# Altium schematic sheet schematic.SchDoc
size A2; SheetNumber: 6; SheetTotal: 29
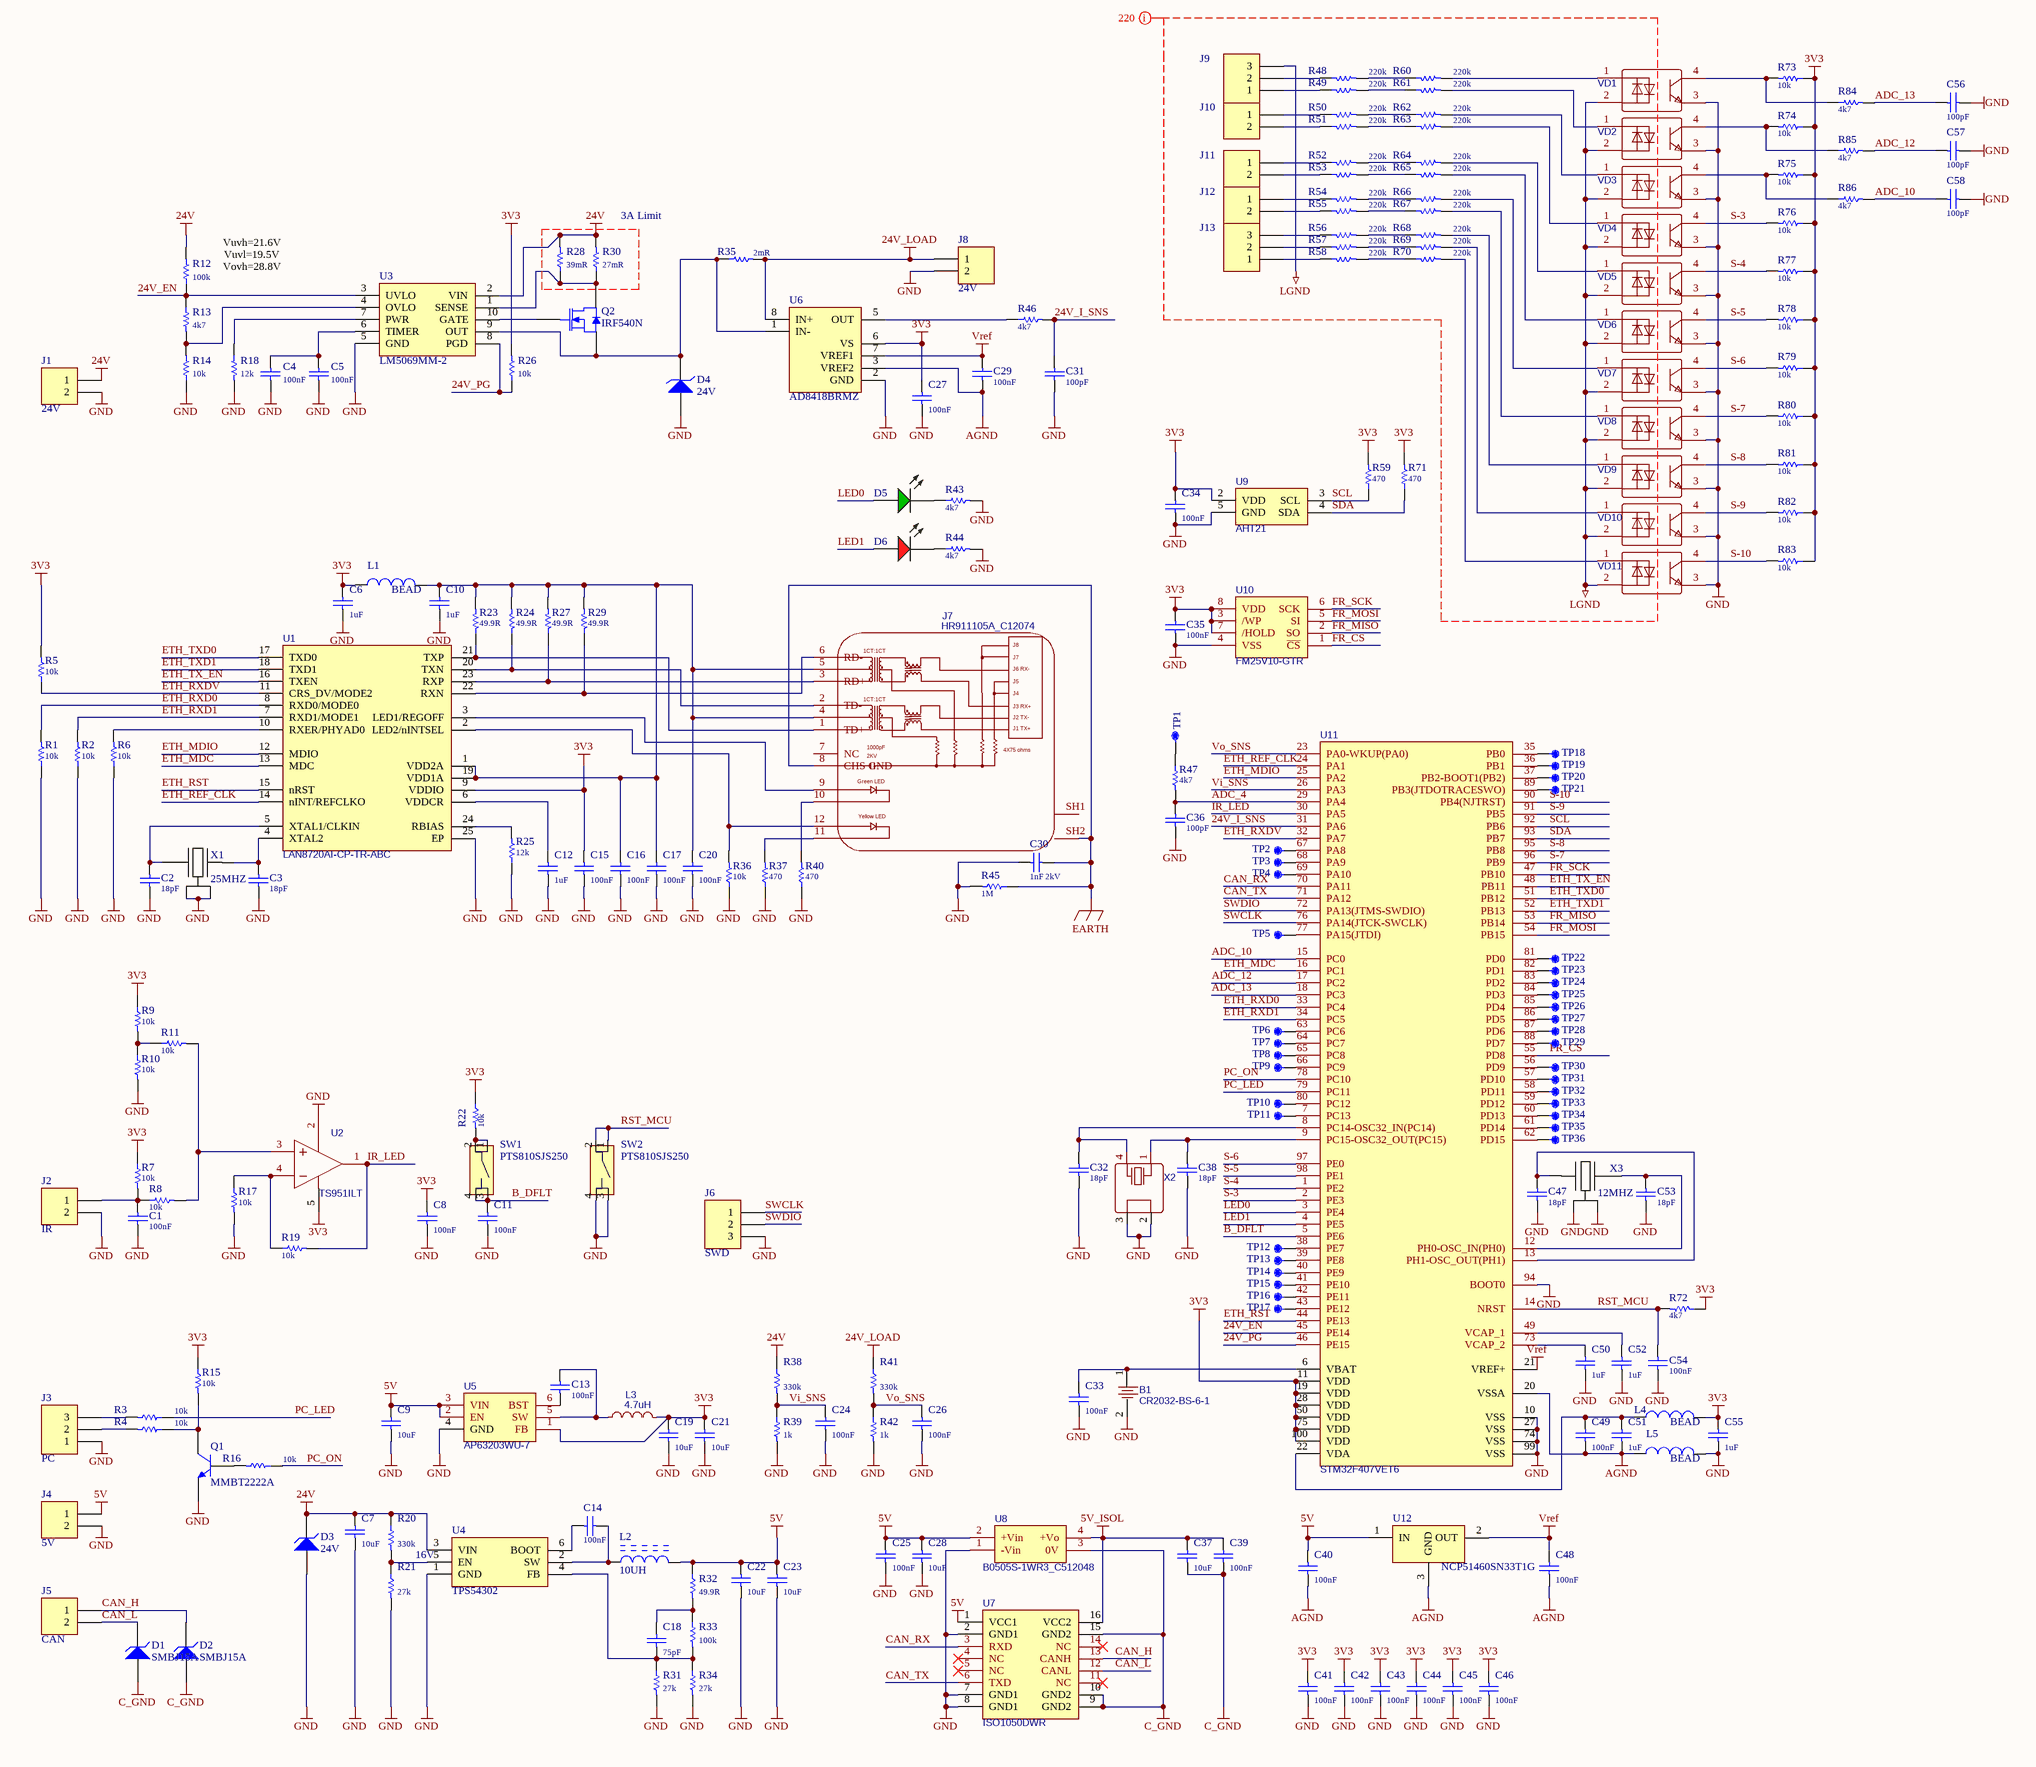
[diagram p0: schematic.SchDoc]

## Parts
B1  CR2032-BS-6-1  [BAT-TH_CR2032-BS-6-1]
C1  100nF  [C0603]
C2  18pF  [C0402]
C3  18pF  [C0402]
C4  100nF  [C0402]
C5  100nF  [C0402]
C6  1uF  [C0603]
C7  10uF  [C1206]
C8  100nF  [C0402]
C9  10uF  [C1206]
C10  1uF  [C0603]
C11  100nF  [C0402]
C12  1uF  [C0603]
C13  100nF  [C0402]
C14  100nF  [C0603]
C15  100nF  [C0402]
C16  100nF  [C0402]
C17  100nF  [C0402]
C18  75pF  [C0603]
C19  10uF  [C1206]
C20  100nF  [C0402]
C21  10uF  [C1206]
C22  10uF  [C1206]
C23  10uF  [C1206]
C24  100nF  [C0603]
C25  100nF  [C0402]
C26  100nF  [C0603]
C27  100nF  [C0402]
C28  10uF  [C1206]
C29  100nF  [C0402]
C30  1nF 2kV  [C1206]
C31  100pF  [C0402]
C32  18pF  [C0402]
C33  100nF  [C0402]
C34  100nF  [C0402]
C35  100nF  [C0402]
C36  100pF  [C0402]
C37  10uF  [C1206]
C38  18pF  [C0402]
C39  100nF  [C0402]
C40  100nF  [C0402]
C41  100nF  [C0402]
C42  100nF  [C0402]
C43  100nF  [C0402]
C44  100nF  [C0402]
C45  100nF  [C0402]
C46  100nF  [C0402]
C47  18pF  [C0402]
C48  100nF  [C0402]
C49  100nF  [C0402]
C50  1uF  [C0603]
C51  1uF  [C0603]
C52  1uF  [C0603]
C53  18pF  [C0402]
C54  100nF  [C0402]
C55  1uF  [C0603]
C56  100pF  [C0402]
C57  100pF  [C0402]
C58  100pF  [C0402]
D1  SMBJ15A  [SMB]
D2  SMBJ15A  [SMB]
D3  24V  [SMB]
D4  24V  [SMC]
D5  GRN  [LED-0603-GRN]  (value not drawn)
D6  RED  [LED-0603-RED]  (value not drawn)
J1  24V  [CONN-TH_2P-P5.08]
J2  IR  [CONN-TH_2P-P5.08]
J3  PC  [CONN-TH_DB127V-5.08-3P]
J4  5V  [CONN-TH_2P-P5.08]
J5  CAN  [CONN-TH_2P-P5.08]
J6  SWD  [HDR-1X3]  (no BOM)
J7  HR911105A_C12074  [RJ45-TH_HR911105A]
J8  24V  [CONN-TH_2P-P5.08]
J9  (no value)  [CONN-TH_DB127V-5.08-3P]
J10  (no value)  [CONN-TH_2P-P5.08]
J11  (no value)  [CONN-TH_2P-P5.08]
J12  (no value)  [CONN-TH_2P-P5.08]
J13  (no value)  [CONN-TH_DB127V-5.08-3P]
L1  BEAD  [L0603]
L2  10UH  [IND-SMD_L7.2-W6.6_GPSR07X0]
L3  4.7uH  [IND-SMD_L4.4-W4.2]
L4  BEAD  [L0402]
L5  BEAD  [L0402]
Q1  MMBT2222A  [SOT-23]
Q2  IRF540N  [D2PAK]
R1  10k  [R0402]
R2  10k  [R0402]
R3  10k  [R0603]
R4  10k  [R0603]
R5  10k  [R0402]
R6  10k  [R0402]
R7  10k  [R0603]
R8  10k  [R0603]
R9  10k  [R0603]
R10  10k  [R0603]
R11  10k  [R0603]
R12  100k  [R0402]
R13  4k7  [R0402]
R14  10k  [R0402]
R15  10k  [R0603]
R16  10k  [R0603]
R17  10k  [R0603]
R18  12k  [R0603]
R19  10k  [R0603]
R20  330k  [R0603]
R21  27k  [R0603]
R22  10k  [R0402]
R23  49.9R  [R0603]
R24  49.9R  [R0603]
R25  12k  [R0402]
R26  10k  [R0402]
R27  49.9R  [R0603]
R28  39mR  [R1206]
R29  49.9R  [R0603]
R30  27mR  [R1206]
R31  27k  [R0603]
R32  49.9R  [R0603]
R33  100k  [R0603]
R34  27k  [R0603]
R35  2mR  [R2512-WIDE]
R36  10k  [R0603]
R37  470  [R0603]
R38  330k  [R0603]
R39  1k  [R0603]
R40  470  [R0603]
R41  330k  [R0603]
R42  1k  [R0603]
R43  4k7  [R0402]
R44  4k7  [R0402]
R45  1M  [R1206]
R46  4k7  [R0402]
R47  4k7  [R0402]
R48  220k  [R1206]
R49  220k  [R1206]
R50  220k  [R1206]
R51  220k  [R1206]
R52  220k  [R1206]
R53  220k  [R1206]
R54  220k  [R1206]
R55  220k  [R1206]
R56  220k  [R1206]
R57  220k  [R1206]
R58  220k  [R1206]
R59  470  [R0603]
R60  220k  [R1206]
R61  220k  [R1206]
R62  220k  [R1206]
R63  220k  [R1206]
R64  220k  [R1206]
R65  220k  [R1206]
R66  220k  [R1206]
R67  220k  [R1206]
R68  220k  [R1206]
R69  220k  [R1206]
R70  220k  [R1206]
R71  470  [R0603]
R72  4k7  [R0402]
R73  10k  [R0603]
R74  10k  [R0603]
R75  10k  [R0603]
R76  10k  [R0603]
R77  10k  [R0603]
R78  10k  [R0603]
R79  10k  [R0603]
R80  10k  [R0603]
R81  10k  [R0603]
R82  10k  [R0603]
R83  10k  [R0603]
R84  4k7  [R0402]
R85  4k7  [R0402]
R86  4k7  [R0402]
SW1  PTS810SJS250  [BTN_PTS810]
SW2  PTS810SJS250  [BTN_PTS810]
TP1  (no value)  [TP_TH_MICRO]  (no BOM)
TP2  (no value)  [TP_TH_MICRO]  (no BOM)
TP3  (no value)  [TP_TH_MICRO]  (no BOM)
TP4  (no value)  [TP_TH_MICRO]  (no BOM)
TP5  (no value)  [TP_TH_MICRO]  (no BOM)
TP6  (no value)  [TP_TH_MICRO]  (no BOM)
TP7  (no value)  [TP_TH_MICRO]  (no BOM)
TP8  (no value)  [TP_TH_MICRO]  (no BOM)
TP9  (no value)  [TP_TH_MICRO]  (no BOM)
TP10  (no value)  [TP_TH_MICRO]  (no BOM)
TP11  (no value)  [TP_TH_MICRO]  (no BOM)
TP12  (no value)  [TP_TH_MICRO]  (no BOM)
TP13  (no value)  [TP_TH_MICRO]  (no BOM)
TP14  (no value)  [TP_TH_MICRO]  (no BOM)
TP15  (no value)  [TP_TH_MICRO]  (no BOM)
TP16  (no value)  [TP_TH_MICRO]  (no BOM)
TP17  (no value)  [TP_TH_MICRO]  (no BOM)
TP18  (no value)  [TP_TH_MICRO]  (no BOM)
TP19  (no value)  [TP_TH_MICRO]  (no BOM)
TP20  (no value)  [TP_TH_MICRO]  (no BOM)
TP21  (no value)  [TP_TH_MICRO]  (no BOM)
TP22  (no value)  [TP_TH_MICRO]  (no BOM)
TP23  (no value)  [TP_TH_MICRO]  (no BOM)
TP24  (no value)  [TP_TH_MICRO]  (no BOM)
TP25  (no value)  [TP_TH_MICRO]  (no BOM)
TP26  (no value)  [TP_TH_MICRO]  (no BOM)
TP27  (no value)  [TP_TH_MICRO]  (no BOM)
TP28  (no value)  [TP_TH_MICRO]  (no BOM)
TP29  (no value)  [TP_TH_MICRO]  (no BOM)
TP30  (no value)  [TP_TH_MICRO]  (no BOM)
TP31  (no value)  [TP_TH_MICRO]  (no BOM)
TP32  (no value)  [TP_TH_MICRO]  (no BOM)
TP33  (no value)  [TP_TH_MICRO]  (no BOM)
TP34  (no value)  [TP_TH_MICRO]  (no BOM)
TP35  (no value)  [TP_TH_MICRO]  (no BOM)
TP36  (no value)  [TP_TH_MICRO]  (no BOM)
U1  LAN8720AI-CP-TR-ABC  [QFN-24_L4.0-W4.0-P0.50-TL-EP2.5]
U2  TS951ILT  [SOT-23-5]
U3  LM5069MM-2  [VSSOP-10 (3x3x0.5)]
U4  TPS54302  [SOT-23-6]
U5  AP63203WU-7  [SOT-23-6]
U6  AD8418BRMZ  [MSOP8]
U7  ISO1050DWR  [SOIC-16_L10.3-W7.5-P1.27-LS10.3-BL]
U8  B0505S-1WR3_C512048  [PWRM-TH_BXXXXS-1WR3]
U9  AHT21  [SENSOR-SMD_L3.0-W3.0-P1.00-BR]
U10  FM25V10-GTR  [SOIC-8]
U11  STM32F407VET6  [LQFP-100]
U12  NCP51460SN33T1G  [SOT-23]
VD1  EL3H4(A)(TA)-VG  [SOP-4_L4.4-W2.8-P1.27-LS7.0-TL]  (value not drawn)
VD2  EL3H4(A)(TA)-VG  [SOP-4_L4.4-W2.8-P1.27-LS7.0-TL]  (value not drawn)
VD3  EL3H4(A)(TA)-VG  [SOP-4_L4.4-W2.8-P1.27-LS7.0-TL]  (value not drawn)
VD4  EL3H4(A)(TA)-VG  [SOP-4_L4.4-W2.8-P1.27-LS7.0-TL]  (value not drawn)
VD5  EL3H4(A)(TA)-VG  [SOP-4_L4.4-W2.8-P1.27-LS7.0-TL]  (value not drawn)
VD6  EL3H4(A)(TA)-VG  [SOP-4_L4.4-W2.8-P1.27-LS7.0-TL]  (value not drawn)
VD7  EL3H4(A)(TA)-VG  [SOP-4_L4.4-W2.8-P1.27-LS7.0-TL]  (value not drawn)
VD8  EL3H4(A)(TA)-VG  [SOP-4_L4.4-W2.8-P1.27-LS7.0-TL]  (value not drawn)
VD9  EL3H4(A)(TA)-VG  [SOP-4_L4.4-W2.8-P1.27-LS7.0-TL]  (value not drawn)
VD10  EL3H4(A)(TA)-VG  [SOP-4_L4.4-W2.8-P1.27-LS7.0-TL]  (value not drawn)
VD11  EL3H4(A)(TA)-VG  [SOP-4_L4.4-W2.8-P1.27-LS7.0-TL]  (value not drawn)
X1  25MHZ  [CRYSTAL_3.2x2.5mm]
X2  32.768kHz  [MC-146]  (value not drawn)
X3  12MHZ  [CRYSTAL_3.2x2.5mm]

## Nets
3V3: C6.2 C8.2 C15.2 C19.2 C21.2 C27.2 C34.2 C35.2 C41.2 C42.2 C43.2 C44.2 C45.2 C46.2 C55.2 L1.2 L3.2 L4.1 R5.2 R7.1 R9.1 R15.1 R22.1 R26.2 R59.2 R71.2 R72.1 R73.1 R74.1 R75.1 R76.1 R77.1 R78.1 R79.1 R80.1 R81.1 R82.1 R83.1 U1.9(VDDIO) U2.5(VCC) U5.1(FB) U6.6(VS) U9.2(VDD) U10.3(/WP) U10.7(/HOLD) U10.8(VDD) U11.11(VDD) U11.19(VDD) U11.28(VDD) U11.50(VDD) U11.75(VDD) U11.100(VDD)
5V: C9.2 C22.2 C23.2 C25.2 C28.2 C40.2 J4.1 L2.2 R32.1 U5.2(EN) U5.3(VIN) U7.1(VCC1) U8.2(+Vin) U12.1(IN)
5V_ISOL: C37.2 C39.2 U7.16(VCC2) U8.4(+Vo)
24V: C7.2 D3.2(K) J1.1 R12.2 R20.1 R28.2 R30.2 R38.1 U3.2(VIN) U4.3(VIN)
24V_LOAD: J8.1 R35.2 R41.1 U6.8(IN+)
AGND: C29.1 C40.1 C48.1 C49.1 C51.1 L5.2 U6.3(VREF2) U11.20(VSSA) U12.3(GND)
C_GND: C37.1 C39.1 D1.1(A) D2.1(A) U7.9(GND2) U7.10(GND2) U7.15(GND2) U8.3(0V)
EARTH: C30.2 J7.8(CHS_GND) J7.SH2 R45.1
GND: B1.2 C1.1 C2.1 C3.1 C4.1 C5.1 C6.1 C7.1 C8.1 C9.1 C10.1 C11.1 C12.1 C15.1 C16.1 C17.1 C19.1 C20.1 C21.1 C22.1 C23.1 C24.1 C25.1 C26.1 C27.1 C28.1 C30.1 C31.2 C32.1 C33.1 C34.1 C35.1 C36.1 C38.1 C41.1 C42.1 C43.1 C44.1 C45.1 C46.1 C47.1 C50.1 C52.1 C53.1 C54.1 C55.1 C56.1 C57.1 C58.1 D3.1(A) D4.2(-) J1.2 J2.2 J3.1 J4.2 J6.3 J8.2 L5.1 Q1.2(E) R1.1 R2.1 R6.1 R10.2 R14.1 R17.2 R18.2 R21.2 R25.1 R31.2 R34.2 R36.1 R37.1 R39.2 R40.1 R42.2 R43.2 R44.2 R45.2 SW2.3 SW2.4 U1.25(EP) U2.2(VDD) U3.5(GND) U4.1(GND) U5.4(GND) U6.2(GND) U7.2(GND1) U7.7(GND1) U7.8(GND1) U8.1(-Vin) U9.5(GND) U10.4(VSS) U11.10(VSS) U11.27(VSS) U11.74(VSS) U11.94(BOOT0) U11.99(VSS) VD1.3(Emitter) VD2.3(Emitter) VD3.3(Emitter) VD4.3(Emitter) VD5.3(Emitter) VD6.3(Emitter) VD7.3(Emitter) VD8.3(Emitter) VD9.3(Emitter) VD10.3(Emitter) VD11.3(Emitter) X1.2(GND) X1.4(GND) X2.2 X2.3 X3.2(GND) X3.4(GND)
LGND: J9.3 VD1.2(Cathode_/_Anode) VD2.2(Cathode_/_Anode) VD3.2(Cathode_/_Anode) VD4.2(Cathode_/_Anode) VD5.2(Cathode_/_Anode) VD6.2(Cathode_/_Anode) VD7.2(Cathode_/_Anode) VD8.2(Cathode_/_Anode) VD9.2(Cathode_/_Anode) VD10.2(Cathode_/_Anode) VD11.2(Cathode_/_Anode)
Vref: C29.2 C48.2 U6.7(VREF1) U11.21(VREF+) U12.2(OUT)
24V_EN: R12.1 R13.1 U3.3(UVLO) U11.45(PE14)
24V_I_SNS: C31.1 R46.2 U11.31(PA6)
24V_PG: R26.1 U3.8(PGD) U11.46(PE15)
ADC_4: C36.2 R47.2 U11.29(PA4)
ADC_10: C58.2 R86.2 U11.15(PC0)
ADC_12: C57.2 R85.2 U11.17(PC2)
ADC_13: C56.2 R84.2 U11.18(PC3)
B_DFLT: C11.2 SW1.3 SW1.4 U11.5(PE6)
CAN_H: D2.2(K) J5.1 U7.13(CANH)
CAN_L: D1.2(K) J5.2 U7.12(CANL)
CAN_RX: U7.3(RXD) U11.70(PA11)
CAN_TX: U7.6(TXD) U11.71(PA12)
ETH_MDC: U1.13(MDC) U11.16(PC1)
ETH_MDIO: U1.12(MDIO) U11.25(PA2)
ETH_REF_CLK: U1.14(nINT/REFCLKO) U11.24(PA1)
ETH_RST: U1.15(nRST) U11.44(PE13)
ETH_RXD0: R1.2 U1.8(RXD0/MODE0) U11.33(PC4)
ETH_RXD1: R2.2 U1.7(RXD1/MODE1) U11.34(PC5)
ETH_RXDV: R5.1 U1.11(CRS_DV/MODE2) U11.32(PA7)
ETH_TX_EN: U1.16(TXEN) U11.48(PB11)
ETH_TXD0: U1.17(TXD0) U11.51(PB12)
ETH_TXD1: U1.18(TXD1) U11.52(PB13)
FR_CS: U10.1(~{CS}) U11.55(PD8)
FR_MISO: U10.2(SO) U11.53(PB14)
FR_MOSI: U10.5(SI) U11.54(PB15)
FR_SCK: U10.6(SCK) U11.47(PB10)
IR_LED: R19.2 U2.1(OUT) U11.30(PA5)
LED0: D5.1(A) U11.3(PE4)
LED1: D6.1(A) U11.4(PE5)
PC_LED: R3.1 U11.79(PC11)
PC_ON: R16.1 U11.78(PC10)
RST_MCU: C54.2 R72.2 SW2.1 SW2.2 U11.14(NRST)
S-3: R76.2 U11.2(PE3) VD4.4(Collector)
S-4: R77.2 U11.1(PE2) VD5.4(Collector)
S-5: R78.2 U11.98(PE1) VD6.4(Collector)
S-6: R79.2 U11.97(PE0) VD7.4(Collector)
S-7: R80.2 U11.96(PB9) VD8.4(Collector)
S-8: R81.2 U11.95(PB8) VD9.4(Collector)
S-9: R82.2 U11.91(PB5) VD10.4(Collector)
S-10: R83.2 U11.90(PB4(NJTRST)) VD11.4(Collector)
SCL: R59.1 U9.3(SCL) U11.92(PB6)
SDA: R71.1 U9.4(SDA) U11.93(PB7)
SWCLK: J6.1 U11.76(PA14(JTCK-SWCLK))
SWDIO: J6.2 U11.72(PA13(JTMS-SWDIO))
Vi_SNS: C24.2 R38.2 R39.1 U11.26(PA3)
Vo_SNS: C26.2 R41.2 R42.1 U11.23(PA0-WKUP(PA0))
NetB1_1: B1.1 C33.2 U11.6(VBAT)
NetC1_2: C1.2 J2.1 R7.2 R8.1
NetC2_2: C2.2 U1.5(XTAL1/CLKIN) X1.3(X2)
NetC3_2: C3.2 U1.4(XTAL2) X1.1(X1)
NetC4_2: C4.2 C5.2 U3.6(TIMER)
NetC10_2: C10.2 C16.2 C17.2 C20.2 J7.4 J7.5 L1.1 R23.2 R24.2 R27.2 R29.2 U1.1(VDD2A) U1.19(VDD1A)
NetC12_2: C12.2 U1.6(VDDCR)
NetC13_1: C13.1 U5.6(BST)
NetC13_2: C13.2 L3.1 U5.5(SW)
NetC14_1: C14.1 U4.6(BOOT)
NetC14_2: C14.2 L2.1 U4.2(SW)
NetC18_1: C18.1 R31.1 R33.2 R34.1 U4.4(FB)
NetC18_2: C18.2 R32.2 R33.1
NetC32_2: C32.2 U11.8(PC14-OSC32_IN(PC14)) X2.4(OSC2)
NetC38_2: C38.2 U11.9(PC15-OSC32_OUT(PC15)) X2.1(OSC1)
NetC47_2: C47.2 U11.13(PH1-OSC_OUT(PH1)) X3.1(X1)
NetC49_2: C49.2 C51.2 L4.2 U11.22(VDA)
NetC50_2: C50.2 U11.73(VCAP_2)
NetC52_2: C52.2 U11.49(VCAP_1)
NetC53_2: C53.2 U11.12(PH0-OSC_IN(PH0)) X3.3(X2)
NetD4_1: D4.1(+) Q2.3(SOURCE) R35.1 U3.9(OUT) U6.1(IN-)
NetD5_2: D5.2(K) R43.1
NetD6_2: D6.2(K) R44.1
NetJ3_2: J3.2 R4.2
NetJ3_3: J3.3 R3.2
NetJ7_1: J7.1(TD+) R23.1 U1.21(TXP)
NetJ7_2: J7.2(TD-) R24.1 U1.20(TXN)
NetJ7_3: J7.3(RD+) R27.1 U1.23(RXP)
NetJ7_6: J7.6(RD-) R29.1 U1.22(RXN)
NetJ7_9: J7.9 U1.3(LED1/REGOFF)
NetJ7_10: J7.10 R40.2
NetJ7_11: J7.11 R37.2
NetJ7_12: J7.12 R36.2 U1.2(LED2/nINTSEL)
NetJ9_1: J9.1 R49.1
NetJ9_2: J9.2 R48.1
NetJ10_1: J10.1 R50.1
NetJ10_2: J10.2 R51.1
NetJ11_1: J11.1 R52.1
NetJ11_2: J11.2 R53.1
NetJ12_1: J12.1 R54.1
NetJ12_2: J12.2 R55.1
NetJ13_1: J13.1 R58.1
NetJ13_2: J13.2 R57.1
NetJ13_3: J13.3 R56.1
NetQ1_1: Q1.1(B) R16.2
NetQ1_3: Q1.3(C) R4.1 R15.2
NetQ2_1: Q2.1(GATE) U3.10(GATE)
NetQ2_2: Q2.2(DRAIN) R28.1 R30.1 U3.1(SENSE)
NetR6_2: R6.2 U1.10(RXER/PHYAD0)
NetR8_2: R8.2 R11.2 U2.3(+IN)
NetR9_2: R9.2 R10.1 R11.1
NetR13_2: R13.2 R14.2 U3.4(OVLO)
NetR17_1: R17.1 R19.1 U2.4(-IN)
NetR18_1: R18.1 U3.7(PWR)
NetR20_2: R20.2 R21.1 U4.5(EN)
NetR22_2: R22.2 SW1.1 SW1.2
NetR25_2: R25.2 U1.24(RBIAS)
NetR46_1: R46.1 U6.5(OUT)
NetR47_1: R47.1 TP1.1
NetR48_2: R48.2 R60.1
NetR49_2: R49.2 R61.1
NetR50_2: R50.2 R62.1
NetR51_2: R51.2 R63.1
NetR52_2: R52.2 R64.1
NetR53_2: R53.2 R65.1
NetR54_2: R54.2 R66.1
NetR55_2: R55.2 R67.1
NetR56_2: R56.2 R68.1
NetR57_2: R57.2 R69.1
NetR58_2: R58.2 R70.1
NetR60_2: R60.2 VD1.1(Anode_/_Cathode)
NetR61_2: R61.2 VD2.1(Anode_/_Cathode)
NetR62_2: R62.2 VD3.1(Anode_/_Cathode)
NetR63_2: R63.2 VD4.1(Anode_/_Cathode)
NetR64_2: R64.2 VD5.1(Anode_/_Cathode)
NetR65_2: R65.2 VD6.1(Anode_/_Cathode)
NetR66_2: R66.2 VD7.1(Anode_/_Cathode)
NetR67_2: R67.2 VD8.1(Anode_/_Cathode)
NetR68_2: R68.2 VD9.1(Anode_/_Cathode)
NetR69_2: R69.2 VD10.1(Anode_/_Cathode)
NetR70_2: R70.2 VD11.1(Anode_/_Cathode)
NetR73_2: R73.2 R84.1 VD1.4(Collector)
NetR74_2: R74.2 R85.1 VD2.4(Collector)
NetR75_2: R75.2 R86.1 VD3.4(Collector)
NetTP2_1: TP2.1 U11.67(PA8)
NetTP3_1: TP3.1 U11.68(PA9)
NetTP4_1: TP4.1 U11.69(PA10)
NetTP5_1: TP5.1 U11.77(PA15(JTDI))
NetTP6_1: TP6.1 U11.63(PC6)
NetTP7_1: TP7.1 U11.64(PC7)
NetTP8_1: TP8.1 U11.65(PC8)
NetTP9_1: TP9.1 U11.66(PC9)
NetTP10_1: TP10.1 U11.80(PC12)
NetTP11_1: TP11.1 U11.7(PC13)
NetTP12_1: TP12.1 U11.38(PE7)
NetTP13_1: TP13.1 U11.39(PE8)
NetTP14_1: TP14.1 U11.40(PE9)
NetTP15_1: TP15.1 U11.41(PE10)
NetTP16_1: TP16.1 U11.42(PE11)
NetTP17_1: TP17.1 U11.43(PE12)
NetTP18_1: TP18.1 U11.35(PB0)
NetTP19_1: TP19.1 U11.36(PB1)
NetTP20_1: TP20.1 U11.37(PB2-BOOT1(PB2))
NetTP21_1: TP21.1 U11.89(PB3(JTDOTRACESWO))
NetTP22_1: TP22.1 U11.81(PD0)
NetTP23_1: TP23.1 U11.82(PD1)
NetTP24_1: TP24.1 U11.83(PD2)
NetTP25_1: TP25.1 U11.84(PD3)
NetTP26_1: TP26.1 U11.85(PD4)
NetTP27_1: TP27.1 U11.86(PD5)
NetTP28_1: TP28.1 U11.87(PD6)
NetTP29_1: TP29.1 U11.88(PD7)
NetTP30_1: TP30.1 U11.56(PD9)
NetTP31_1: TP31.1 U11.57(PD10)
NetTP32_1: TP32.1 U11.58(PD11)
NetTP33_1: TP33.1 U11.59(PD12)
NetTP34_1: TP34.1 U11.60(PD13)
NetTP35_1: TP35.1 U11.61(PD14)
NetTP36_1: TP36.1 U11.62(PD15)

Not connected (* = marked no-connect by the designer): J7 7(NC) SH1; U7 4(NC)* 5(NC)* 11(NC)* 14(NC)*

## Layout directives
net class 220: LGND

## Notes on the sheet
- (near R30) 3A Limit
- Vuvh=21.6V
  Vuvl=19.5V
  Vovh=28.8V
- 16V
- (in symbol HR911105A_C12074) J8; 1CT:1CT; J6 RX-; J5; J4; J3 RX+; J2 TX-; J1 TX+; 1000pF; 4X75 ohms; 2KV; Green LED; Yellow LED

## Library data of the parts
C1 C14 C24 C26 = CAP: 100nF 0603
C2 C3 C32 C38 C47 C53 = CAP: 10pF 0402
C4 C5 C8 C11 C13 C15-C17 C20 C25 C27 C29 C33-C35 C39-C46 C48 C49 C54 = CAP: 100nF 0402
C6 C10 C12 C50-C52 C55 = CAP: 1uF 0603
C7 C9 C19 C21-C23 C28 C37 = CAP: 10uF 1206
C18 = CAP: 75pF 0603
C30 = CAP: 1nF 2kV 1206
C31 C36 C56-C58 = CAP: 100pF 0402
D1 D2 = SMCJ54A
D3 = SMCJ54A: P6SMB24A
D4 = NCP51460SN33T1G: 1.5SMC24A-E3/57T
D5 = LED-0603-GREEN: LED 0603 GRN
D6 = LED-0603-RED: LED 0603 RED
J1 J2 J4 J5 J8 J10-J12 = CONN MOLEX HDR-M 1x4
J3 J9 J13 = CONN MOLEX HDR-M 1x12
J6 = Header 3
L1 L4 L5 = BLM18AG601SN1D: BEAD 0402
L2 = SRN3015-100M: CYA0630-10UH
L3 = 4.7uH: FXL0420-4R7-M
Q1 = MMBT2222ALT1G: MMBT2222
Q2 = BSC123N10LSGATMA1
R1 R2 R5 R6 = RES_0402_1K5-1%: 10k 0402
R3 R4 R7-R11 R15-R17 R19 R36 R73-R83 = RES_0402_1K5-1%: 10k 0603
R12 = R0402_Dup1: 100k 0402
R13 R43 R44 R46 R47 R72 R84-R86 = RES: 4k7 0402
R14 R22 R26 = R0201: 10k 0402
R18 = RES: 12k 0603
R20 R38 R41 = RES: 330k 0603
R21 R31 R34 = RES: 27k 0603
R23 R24 R27 R29 = RES: 49.9R 0603
R25 = RES: 12k 0402
R28 = R0201: 39mR 1206
R30 = R0201: 27mR 1206
R32 = R0201: 49.9R 0603
R33 = RES: 100k 0603
R35 = RES: 2mR shunt 2512
R37 R40 R59 R71 = RES_0402_1K5-1%: 470R 0603
R39 R42 = R0201: 1k 0603
R45 = RES_0402_1K5-1%: 1M 1206
R48-R58 R60-R70 = RES: 220k 1206
SW1 SW2 = Component_1
TP1-TP36 = TP_Dup1
U3 = TPS2491
U4 = LM27313XMFX: TPS54302DDCR
X1 = CRYSTAL 12MHZ 3.20mm x 2.50mm: X322525MOB4SI
X3 = CRYSTAL 12MHZ 3.20mm x 2.50mm: X322512MOB4SI